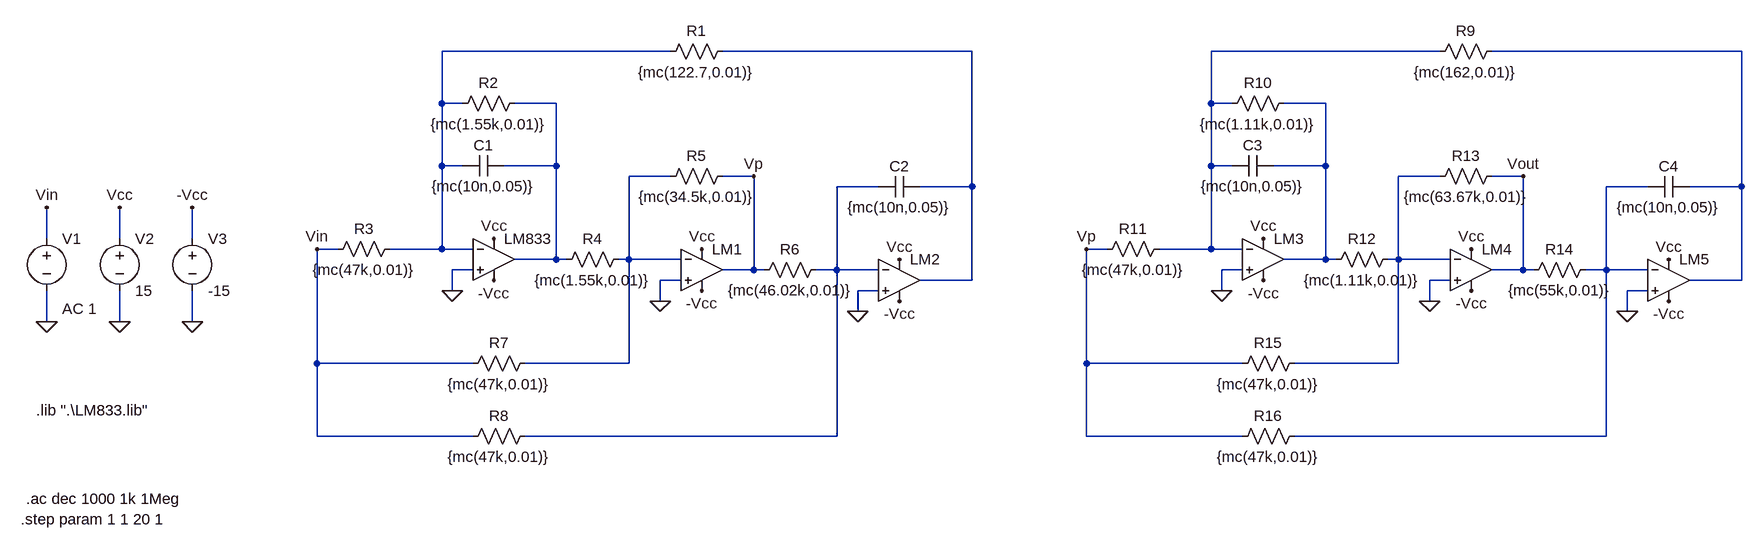
[diagram p0: schematic FT-LM833-MC.asc]
FT-LM833-MC.asc, the LTspice schematic file:
Version 4
SHEET 1 2472 680
WIRE 480 -160 128 -160
WIRE 944 -160 560 -160
WIRE 1664 -160 1312 -160
WIRE 2128 -160 1744 -160
WIRE 128 -80 128 -160
WIRE 160 -80 128 -80
WIRE 304 -80 240 -80
WIRE 1312 -80 1312 -160
WIRE 1344 -80 1312 -80
WIRE 1488 -80 1424 -80
WIRE 128 16 128 -80
WIRE 160 16 128 16
WIRE 304 16 304 -80
WIRE 304 16 224 16
WIRE 1312 16 1312 -80
WIRE 1344 16 1312 16
WIRE 1488 16 1488 -80
WIRE 1488 16 1408 16
WIRE 480 32 416 32
WIRE 608 32 560 32
WIRE 1664 32 1600 32
WIRE 1792 32 1744 32
WIRE 800 48 736 48
WIRE 944 48 944 -160
WIRE 944 48 864 48
WIRE 1984 48 1920 48
WIRE 2128 48 2128 -160
WIRE 2128 48 2048 48
WIRE -480 128 -480 80
WIRE -368 128 -368 80
WIRE -256 128 -256 80
WIRE -32 144 -64 144
WIRE 128 144 128 16
WIRE 128 144 48 144
WIRE 176 144 128 144
WIRE 1152 144 1120 144
WIRE 1312 144 1312 16
WIRE 1312 144 1232 144
WIRE 1360 144 1312 144
WIRE 304 160 304 16
WIRE 304 160 240 160
WIRE 320 160 304 160
WIRE 416 160 416 32
WIRE 416 160 400 160
WIRE 496 160 416 160
WIRE 1488 160 1488 16
WIRE 1488 160 1424 160
WIRE 1504 160 1488 160
WIRE 1600 160 1600 32
WIRE 1600 160 1584 160
WIRE 1680 160 1600 160
WIRE 176 176 144 176
WIRE 608 176 608 32
WIRE 608 176 560 176
WIRE 624 176 608 176
WIRE 736 176 736 48
WIRE 736 176 704 176
WIRE 800 176 736 176
WIRE 1360 176 1328 176
WIRE 1792 176 1792 32
WIRE 1792 176 1744 176
WIRE 1808 176 1792 176
WIRE 1920 176 1920 48
WIRE 1920 176 1888 176
WIRE 1984 176 1920 176
WIRE 496 192 464 192
WIRE 944 192 944 48
WIRE 944 192 864 192
WIRE 1680 192 1648 192
WIRE 2128 192 2128 48
WIRE 2128 192 2048 192
WIRE 144 208 144 176
WIRE 800 208 768 208
WIRE 1328 208 1328 176
WIRE 1984 208 1952 208
WIRE 464 224 464 192
WIRE 1648 224 1648 192
WIRE 768 240 768 208
WIRE 1952 240 1952 208
WIRE -480 256 -480 208
WIRE -368 256 -368 208
WIRE -256 256 -256 208
WIRE -64 320 -64 144
WIRE 176 320 -64 320
WIRE 416 320 416 160
WIRE 416 320 256 320
WIRE 1120 320 1120 144
WIRE 1360 320 1120 320
WIRE 1600 320 1600 160
WIRE 1600 320 1440 320
WIRE -64 432 -64 320
WIRE 176 432 -64 432
WIRE 736 432 736 176
WIRE 736 432 256 432
WIRE 1120 432 1120 320
WIRE 1360 432 1120 432
WIRE 1920 432 1920 176
WIRE 1920 432 1440 432
FLAG -480 256 0
FLAG -368 256 0
FLAG -256 256 0
FLAG -480 80 Vin
FLAG -368 80 Vcc
FLAG 208 128 Vcc
FLAG -256 80 -Vcc
FLAG 208 192 -Vcc
FLAG 144 208 0
FLAG 528 144 Vcc
FLAG 528 208 -Vcc
FLAG 464 224 0
FLAG 832 160 Vcc
FLAG 832 224 -Vcc
FLAG 768 240 0
FLAG 608 32 Vp
FLAG 1392 128 Vcc
FLAG 1392 192 -Vcc
FLAG 1328 208 0
FLAG 1712 144 Vcc
FLAG 1712 208 -Vcc
FLAG 1648 224 0
FLAG 2016 160 Vcc
FLAG 2016 224 -Vcc
FLAG 1952 240 0
FLAG 1792 32 Vout
FLAG 1120 144 Vp
FLAG -64 144 Vin
SYMBOL voltage -480 112 R0
WINDOW 123 24 124 Left 2
WINDOW 39 0 0 Left 0
SYMATTR Value2 AC 1
SYMATTR InstName V1
SYMATTR Value ""
SYMBOL voltage -368 112 R0
SYMATTR InstName V2
SYMATTR Value 15
SYMBOL voltage -256 112 R0
SYMATTR InstName V3
SYMATTR Value -15
SYMBOL Opamps\\UniversalOpamp2 208 160 R0
SYMATTR InstName LM833
SYMBOL Opamps\\UniversalOpamp2 528 176 R0
SYMATTR InstName LM1
SYMBOL Opamps\\UniversalOpamp2 832 192 R0
SYMATTR InstName LM2
SYMBOL res 576 -176 R90
WINDOW 0 0 56 VBottom 2
WINDOW 3 32 56 VTop 2
SYMATTR InstName R1
SYMATTR Value {mc(122.7,0.01)}
SYMBOL res 256 -96 R90
WINDOW 0 0 56 VBottom 2
WINDOW 3 32 56 VTop 2
SYMATTR InstName R2
SYMATTR Value {mc(1.55k,0.01)}
SYMBOL res 64 128 R90
WINDOW 0 0 56 VBottom 2
WINDOW 3 32 56 VTop 2
SYMATTR InstName R3
SYMATTR Value {mc(47k,0.01)}
SYMBOL res 416 144 R90
WINDOW 0 0 56 VBottom 2
WINDOW 3 32 56 VTop 2
SYMATTR InstName R4
SYMATTR Value {mc(1.55k,0.01)}
SYMBOL res 576 16 R90
WINDOW 0 0 56 VBottom 2
WINDOW 3 32 56 VTop 2
SYMATTR InstName R5
SYMATTR Value {mc(34.5k,0.01)}
SYMBOL res 720 160 R90
WINDOW 0 0 56 VBottom 2
WINDOW 3 32 56 VTop 2
SYMATTR InstName R6
SYMATTR Value {mc(46.02k,0.01)}
SYMBOL res 272 304 R90
WINDOW 0 0 56 VBottom 2
WINDOW 3 32 56 VTop 2
SYMATTR InstName R7
SYMATTR Value {mc(47k,0.01)}
SYMBOL res 272 416 R90
WINDOW 0 0 56 VBottom 2
WINDOW 3 32 56 VTop 2
SYMATTR InstName R8
SYMATTR Value {mc(47k,0.01)}
SYMBOL cap 224 0 R90
WINDOW 0 0 32 VBottom 2
WINDOW 3 32 32 VTop 2
SYMATTR InstName C1
SYMATTR Value {mc(10n,0.05)}
SYMBOL cap 864 32 R90
WINDOW 0 0 32 VBottom 2
WINDOW 3 32 32 VTop 2
SYMATTR InstName C2
SYMATTR Value {mc(10n,0.05)}
SYMBOL Opamps\\UniversalOpamp2 1392 160 R0
SYMATTR InstName LM3
SYMBOL Opamps\\UniversalOpamp2 1712 176 R0
SYMATTR InstName LM4
SYMBOL Opamps\\UniversalOpamp2 2016 192 R0
SYMATTR InstName LM5
SYMBOL res 1760 -176 R90
WINDOW 0 0 56 VBottom 2
WINDOW 3 32 56 VTop 2
SYMATTR InstName R9
SYMATTR Value {mc(162,0.01)}
SYMBOL res 1440 -96 R90
WINDOW 0 0 56 VBottom 2
WINDOW 3 32 56 VTop 2
SYMATTR InstName R10
SYMATTR Value {mc(1.11k,0.01)}
SYMBOL res 1248 128 R90
WINDOW 0 0 56 VBottom 2
WINDOW 3 32 56 VTop 2
SYMATTR InstName R11
SYMATTR Value {mc(47k,0.01)}
SYMBOL res 1600 144 R90
WINDOW 0 0 56 VBottom 2
WINDOW 3 32 56 VTop 2
SYMATTR InstName R12
SYMATTR Value {mc(1.11k,0.01)}
SYMBOL res 1760 16 R90
WINDOW 0 0 56 VBottom 2
WINDOW 3 32 56 VTop 2
SYMATTR InstName R13
SYMATTR Value {mc(63.67k,0.01)}
SYMBOL res 1904 160 R90
WINDOW 0 0 56 VBottom 2
WINDOW 3 32 56 VTop 2
SYMATTR InstName R14
SYMATTR Value {mc(55k,0.01)}
SYMBOL res 1456 304 R90
WINDOW 0 0 56 VBottom 2
WINDOW 3 32 56 VTop 2
SYMATTR InstName R15
SYMATTR Value {mc(47k,0.01)}
SYMBOL res 1456 416 R90
WINDOW 0 0 56 VBottom 2
WINDOW 3 32 56 VTop 2
SYMATTR InstName R16
SYMATTR Value {mc(47k,0.01)}
SYMBOL cap 1408 0 R90
WINDOW 0 0 32 VBottom 2
WINDOW 3 32 32 VTop 2
SYMATTR InstName C3
SYMATTR Value {mc(10n,0.05)}
SYMBOL cap 2048 32 R90
WINDOW 0 0 32 VBottom 2
WINDOW 3 32 32 VTop 2
SYMATTR InstName C4
SYMATTR Value {mc(10n,0.05)}
TEXT -496 392 Left 2 !.lib ".\\LM833.lib"
TEXT -512 528 Left 2 !.ac dec 1000 1k 1Meg
TEXT -520 560 Left 2 !.step param 1 1 20 1

The netlist it stands for:
* FT-LM833-MC.asc
V1 Vin 0 AC 1
V2 Vcc 0 15
V3 -Vcc 0 -15
XLM833 0 N001 Vcc -Vcc N005 level.2 Avol=1Meg GBW=10Meg Slew=10Meg ilimit=25m rail=0 Vos=0 phimargin=45 en=0 enk=0 in=0 ink=0 Rin=500Meg  ; pins IN+ IN- V+ V- OUT
XLM1 0 N007 Vcc -Vcc Vp level.2 Avol=1Meg GBW=10Meg Slew=10Meg ilimit=25m rail=0 Vos=0 phimargin=45 en=0 enk=0 in=0 ink=0 Rin=500Meg  ; pins IN+ IN- V+ V- OUT
XLM2 0 N009 Vcc -Vcc N002 level.2 Avol=1Meg GBW=10Meg Slew=10Meg ilimit=25m rail=0 Vos=0 phimargin=45 en=0 enk=0 in=0 ink=0 Rin=500Meg  ; pins IN+ IN- V+ V- OUT
R1 N002 N001 {mc(122.7,0.01)}
R2 N005 N001 {mc(1.55k,0.01)}
R3 N001 Vin {mc(47k,0.01)}
R4 N007 N005 {mc(1.55k,0.01)}
R5 Vp N007 {mc(34.5k,0.01)}
R6 N009 Vp {mc(46.02k,0.01)}
R7 N007 Vin {mc(47k,0.01)}
R8 N009 Vin {mc(47k,0.01)}
C1 N005 N001 {mc(10n,0.05)}
C2 N002 N009 {mc(10n,0.05)}
XLM3 0 N003 Vcc -Vcc N006 level.2 Avol=1Meg GBW=10Meg Slew=10Meg ilimit=25m rail=0 Vos=0 phimargin=45 en=0 enk=0 in=0 ink=0 Rin=500Meg  ; pins IN+ IN- V+ V- OUT
XLM4 0 N008 Vcc -Vcc Vout level.2 Avol=1Meg GBW=10Meg Slew=10Meg ilimit=25m rail=0 Vos=0 phimargin=45 en=0 enk=0 in=0 ink=0 Rin=500Meg  ; pins IN+ IN- V+ V- OUT
XLM5 0 N010 Vcc -Vcc N004 level.2 Avol=1Meg GBW=10Meg Slew=10Meg ilimit=25m rail=0 Vos=0 phimargin=45 en=0 enk=0 in=0 ink=0 Rin=500Meg  ; pins IN+ IN- V+ V- OUT
R9 N004 N003 {mc(162,0.01)}
R10 N006 N003 {mc(1.11k,0.01)}
R11 N003 Vp {mc(47k,0.01)}
R12 N008 N006 {mc(1.11k,0.01)}
R13 Vout N008 {mc(63.67k,0.01)}
R14 N010 Vout {mc(55k,0.01)}
R15 N008 Vp {mc(47k,0.01)}
R16 N010 Vp {mc(47k,0.01)}
C3 N006 N003 {mc(10n,0.05)}
C4 N004 N010 {mc(10n,0.05)}
.lib ".\LM833.lib"
.ac dec 1000 1k 1Meg
.step param 1 1 20 1
.lib UniversalOpamps2.sub
.backanno
.end